# EAGLE design gateway_v1.2A (EAGLE 9.2.0)
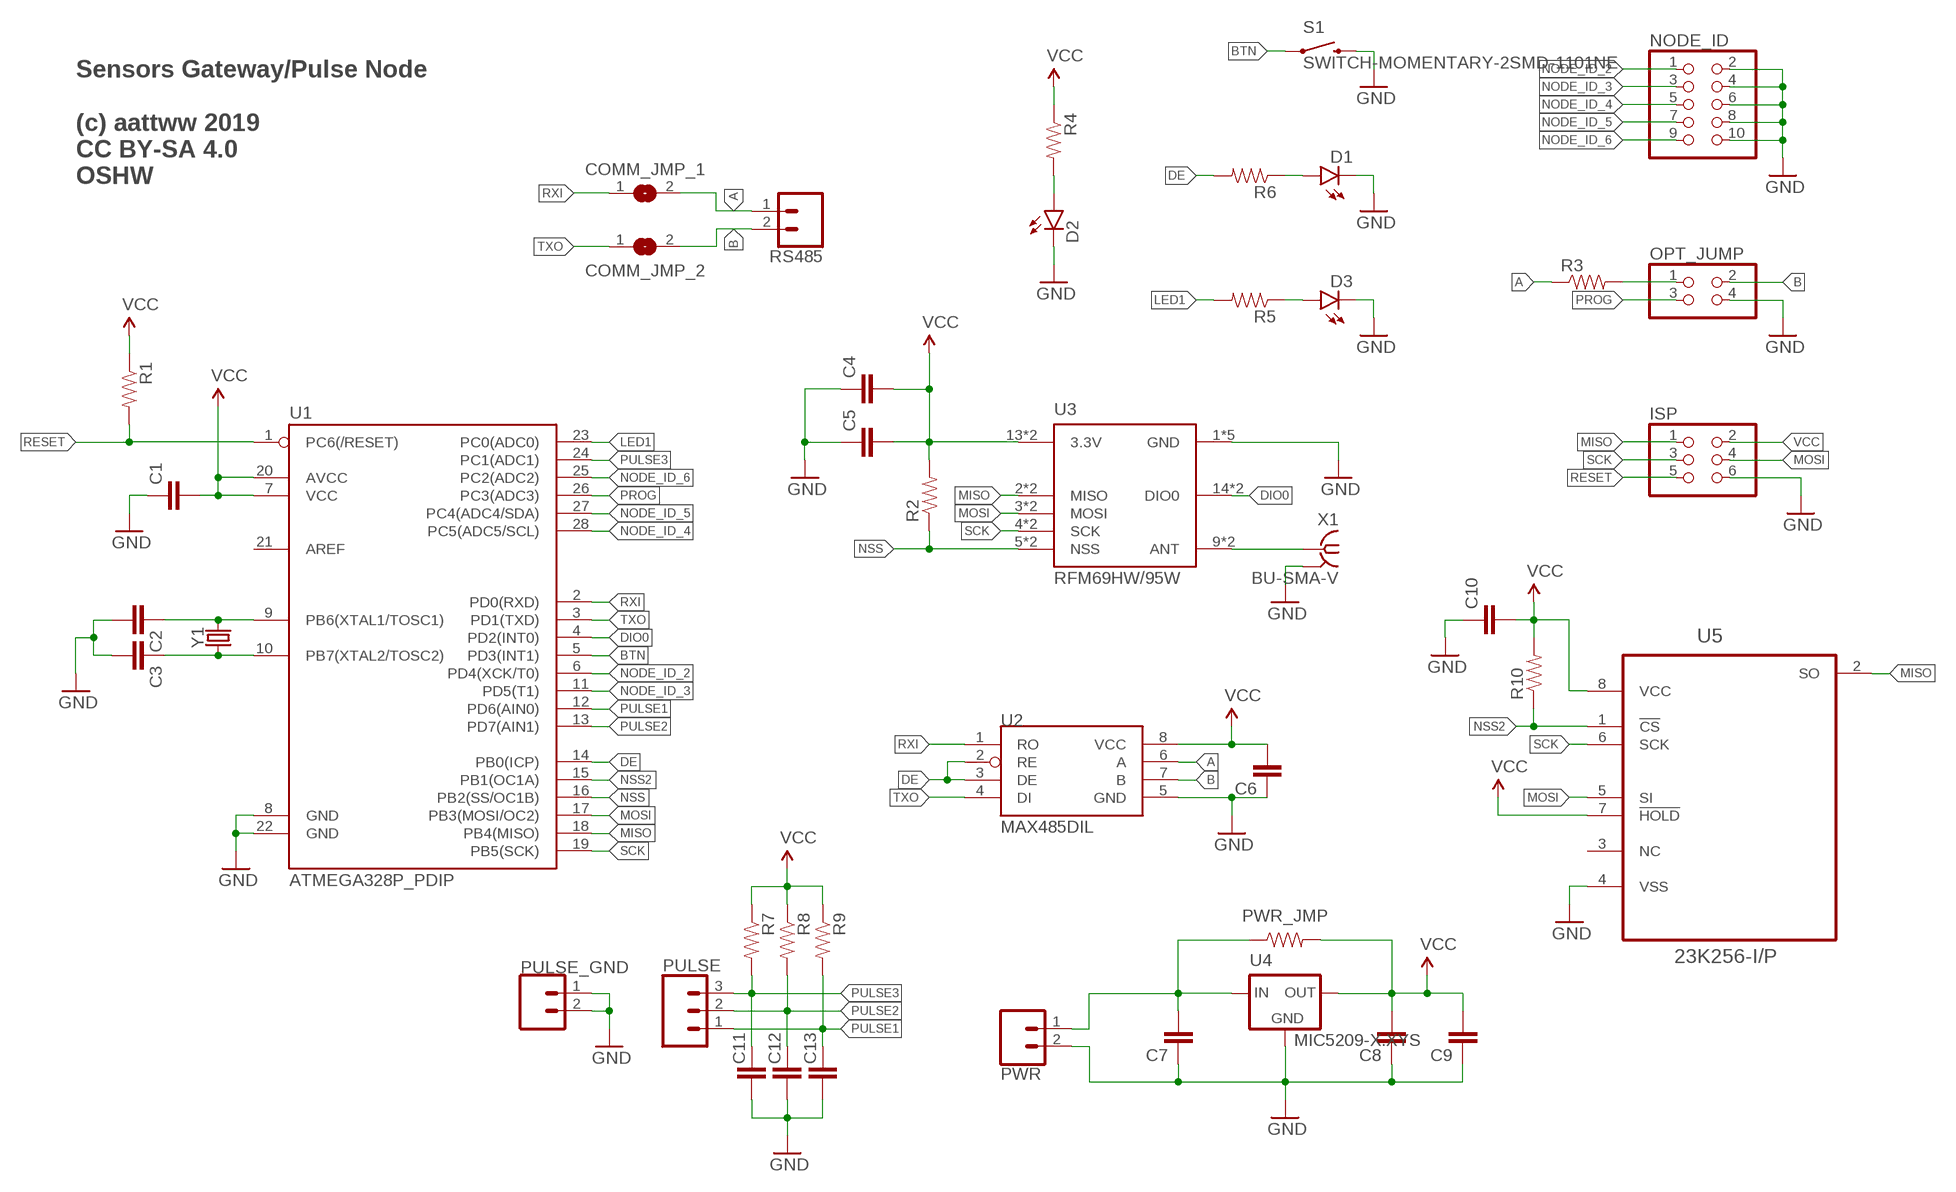
[diagram p0: schematic, sheet 1]

## Parts
C1  CAP1206  [1206]
C2  CAP1206  [1206]
C3  CAP1206  [1206]
C4  CAP1206  [1206]
C5  CAP1206  [1206]
C6  CAP1206  [1206]
C7  CAP1206  [1206]
C8  CAP1206  [1206]
C9  CAP1206  [1206]
C10  CAP1206  [1206]
C11  CAP1206  [1206]
C12  CAP1206  [1206]
C13  CAP1206  [1206]
COMM_JMP_1  SJ  [SJ]
COMM_JMP_2  SJ  [SJ]
D1  LED1206  [LED-1206]
D2  LED1206  [LED-1206]
D3  LED1206  [LED-1206]
ISP  PINHD-2X3  [2X03]
NODE_ID  PINHD-2X5  [2X05]
OPT_JUMP  PINHD-2X2  [2X02]
PULSE  CONN_03-SCREW-5MM  [SCREWTERMINAL-5MM-3]
PULSE_GND  CONN_025MM  [SCREWTERMINAL-5MM-2]
PWR  CONN_025MM  [SCREWTERMINAL-5MM-2]
PWR_JMP  RESISTOR1206  [1206]
R1  RESISTOR1206  [1206]
R2  RESISTOR1206  [1206]
R3  RESISTOR1206  [1206]
R4  RESISTOR1206  [1206]
R5  RESISTOR1206  [1206]
R6  RESISTOR1206  [1206]
R7  RESISTOR1206  [1206]
R8  RESISTOR1206  [1206]
R9  RESISTOR1206  [1206]
R10  RESISTOR1206  [1206]
RS485  CONN_025MM  [SCREWTERMINAL-5MM-2]
S1  SWITCH-MOMENTARY-2SMD-1101NE  [TACTILE-SWITCH-1101NE]
U1  ATMEGA328P_PDIP  [DIL28-3]
U2  MAX485DIL  [DIL08]
U3  RFM69HW/95W  [RFM69HW/95W]
U4  MIC5209-X.XYS  [SOT223]
U5  23K256-I/P  [DIP254P762X533-8]
X1  BU-SMA-V  [BU-SMA-V]
Y1  CRYSTALPTH-HC49US  [HC49US]

## Nets
A: COMM_JMP_1.2 R3.1 RS485.1 U2.6(A)
B: COMM_JMP_2.2 OPT_JUMP.2 RS485.2 U2.7(B)
BTN: S1.1 U1.5(PD3(INT1))
DE: R6.2 U1.14(PB0(ICP)) U2.2(RE) U2.3(DE)
DIO0: U1.4(PD2(INT0)) U3.14(DIO0) U3.22(DIO0)
GND: C1.1 C2.2 C3.2 C4.1 C5.1 C6.1 C7.1 C8.1 C9.1 C10.1 C11.2 C12.2 C13.2 D1.C D2.C D3.C ISP.6 NODE_ID.2 NODE_ID.4 NODE_ID.6 NODE_ID.8 NODE_ID.10 OPT_JUMP.4 PULSE_GND.1 PULSE_GND.2 PWR.2 S1.2 U1.8(GND) U1.22(GND) U2.5(GND) U3.1(GND) U3.8(GND) U3.10(GND) U3.29(GND) U3.31(GND) U4.2(GND) U4.4(GND) U5.4(VSS) X1.2 X1.3 X1.4 X1.5
LED1: R5.2 U1.23(PC0(ADC0))
MISO: ISP.1 U1.18(PB4(MISO)) U3.2(MISO) U3.33(MISO) U5.2(SO)
MOSI: ISP.4 U1.17(PB3(MOSI/OC2)) U3.3(MOSI) U3.34(MOSI) U5.5(SI)
N$1: U3.9(ANT) U3.30(ANT) X1.1
N$2: OPT_JUMP.1 R3.2
N$3: C2.1 U1.9(PB6(XTAL1/TOSC1)) Y1.2
N$4: C3.1 U1.10(PB7(XTAL2/TOSC2)) Y1.1
N$5: D2.A R4.2
N$6: D1.A R6.1
N$7: D3.A R5.1
N$8: C7.2 PWR.1 PWR_JMP.1 U4.1(IN)
NODE_ID_2: NODE_ID.1 U1.6(PD4(XCK/T0))
NODE_ID_3: NODE_ID.3 U1.11(PD5(T1))
NODE_ID_4: NODE_ID.5 U1.28(PC5(ADC5/SCL))
NODE_ID_5: NODE_ID.7 U1.27(PC4(ADC4/SDA))
NODE_ID_6: NODE_ID.9 U1.25(PC2(ADC2))
NSS: R2.1 U1.16(PB2(SS/OC1B)) U3.5(NSS) U3.35(NSS)
NSS2: R10.1 U1.15(PB1(OC1A)) U5.1(!CS)
PROG: OPT_JUMP.3 U1.26(PC3(ADC3))
PULSE1: C13.1 PULSE.1 R9.2 U1.12(PD6(AIN0))
PULSE2: C12.1 PULSE.2 R8.2 U1.13(PD7(AIN1))
PULSE3: C11.1 PULSE.3 R7.2 U1.24(PC1(ADC1))
RESET: ISP.5 R1.2 U1.1(PC6(/RESET))
RXI: COMM_JMP_1.1 U1.2(PD0(RXD)) U2.1(RO)
SCK: ISP.3 U1.19(PB5(SCK)) U3.4(SCK) U3.32(SCK) U5.6(SCK)
TXO: COMM_JMP_2.1 U1.3(PD1(TXD)) U2.4(DI)
VCC: C1.2 C4.2 C5.2 C6.2 C8.2 C9.2 C10.2 ISP.2 PWR_JMP.2 R1.1 R2.2 R4.1 R7.1 R8.1 R9.1 R10.2 U1.7(VCC) U1.20(AVCC) U2.8(VCC) U3.13(3.3V) U3.28(3.3V) U4.3(OUT) U5.7(!HOLD!) U5.8(VCC)
Unconnected: U1.21(AREF) U5.3(NC)

## Notes on the sheet
- Sensors Gateway/Pulse Node
  
  (c) aattww 2019
  CC BY-SA 4.0
  OSHW

## Library data of the parts
C1-C13 = SparkFun-Passives:CAP: Capacitor Standard 0603 ceramic capacitor, and 0.1" leaded capacitor.
COMM_JMP_1 COMM_JMP_2 = jumper:SJ: SMD solder JUMPER
D1-D3 = SparkFun-LED:LED: LEDs Standard schematic elements and footprints for 5mm, 3mm, 1206, and 0603 sized LEDs. 5mm - Spark Fun Electronics SKU : COM-00529 (and others)
ISP = pinhead:PINHD-2X3: PIN HEADER
NODE_ID = pinhead:PINHD-2X5: PIN HEADER
OPT_JUMP = pinhead:PINHD-2X2: PIN HEADER
PULSE = SparkFun-Connectors:CONN_03: Multi connection point. Often used as Generic Header-pin footprint for 0.1 inch spaced/style header connections On any of the 0.1 inch spaced packages, you can populate with these: Break Away Headers - Straight <https://www.sparkfun.com/products/116> (PRT-00116) Break Away Male Headers - Right Angle <https://www.sparkfun.com/products/553> (PRT-00553) Female Headers <https://www.sparkfun.com/products/115> (PRT-00115) Break Away Headers - Machine Pin <https://www.sparkfun.com/products/117> (PRT-00117) Break Away Female Headers - Swiss Machine Pin <https://www.sparkfun.com/products/743> (PRT-00743) Stackable Header - 3 Pin (Female, 0.1") <https://www.sparkfun.com/products/13875> (PRT-13875) For SCREWTERMINALS and SPRING TERMINALS visit here: Screw Terimnals on SparkFun.com <https://www.sparkfun.com/search/results?term=Screw+Terminals> (5mm/3.5mm/2.54mm spacing) This device is also useful as a general connection point to wire up your design to another part of your project. Our various solder wires solder well into these plated through hole pads. Hook-Up Wire - Assortment (Stranded, 22 AWG) <https://www.sparkfun.com/products/11375> (PRT-11375) Hook-Up Wire - Assortment (Solid Core, 22 AWG) <https://www.sparkfun.com/products/11367> (PRT-11367) View the entire wire category on our website here <https://www.sparkfun.com/categories/141> Special notes: Molex polarized connector foot print use with SKU : PRT-08232 with associated crimp pins and housings.; PROD_ID: CONN-10134; SF_SKU: PRT-08433
PULSE_GND PWR RS485 = SparkFun-Connectors:CONN_02: Multi connection point. Often used as Generic Header-pin footprint for 0.1 inch spaced/style header connections On any of the 0.1 inch spaced packages, you can populate with these: Break Away Headers - Straight <https://www.sparkfun.com/products/116> (PRT-00116) Break Away Male Headers - Right Angle <https://www.sparkfun.com/products/553> (PRT-00553) Female Headers <https://www.sparkfun.com/products/115> (PRT-00115) Break Away Headers - Machine Pin <https://www.sparkfun.com/products/117> (PRT-00117) Break Away Female Headers - Swiss Machine Pin <https://www.sparkfun.com/products/743> (PRT-00743) For SCREWTERMINALS and SPRING TERMINALS visit here: Screw Terimnals on SparkFun.com <https://www.sparkfun.com/search/results?term=Screw+Terminals> (5mm/3.5mm/2.54mm spacing) This device is also useful as a general connection point to wire up your design to another part of your project. Our various solder wires solder well into these plated through hole pads. Hook-Up Wire - Assortment (Stranded, 22 AWG) <https://www.sparkfun.com/products/11375> (PRT-11375) Hook-Up Wire - Assortment (Solid Core, 22 AWG) <https://www.sparkfun.com/products/11367> (PRT-11367) View the entire wire category on our website here <https://www.sparkfun.com/categories/141> Special notes: Molex polarized connector foot print use with: PRT-08233 with associated crimp pins and housings. 2.54_SCREWTERM for use with PRT-10571. 3.5mm Screw Terminal footprints for PRT-08084 5mm Screw Terminal footprints for use with PRT-08432; SF_SKU: PRT-08432
PWR_JMP R1-R10 = SparkFun-Passives:RESISTOR: Resistor Basic schematic elements and footprints for 0603, 1206, and PTH resistors.
S1 = SparkFun-Electromechanical:SWITCH-MOMENTARY-2: Various NO switches- pushbuttons, reed, etc; PROD_ID: SWCH-00815
U1 = SparkFun-DigitalIC:ATMEGA328P_PDIP: uC used in the Arduino 32kb flash, 1k EEPROM, 2k SRAM This is the through-hole version of this chip.
U2 = SparkFun-Retired:MAX485: RS-485 transceiver
U3 = custom-rfm:RFM69HW/95W
U4 = micrel:MIC5209-X.XYS: LDO REGULATOR
U5 = Microchip-23K256-I_P:23K256-I/P: SPI Bus Low-Power Serial SRAM,DIP-8; MPN: 23K256-I/P; OC_FARNELL: 1695546; OC_NEWARK: 08P0023; PACKAGE: DIP-8; SUPPLIER: MICROCHIP
X1 = con-coax:BU-SMA-V: FEMALE SMA CONNECTOR Radiall distributor RS 112-3794; OC_FARNELL: unknown; OC_NEWARK: unknown
Y1 = SparkFun-Clocks:CRYSTAL: Crystals (Generic) These are passive quartz crystals, which can be used as a clock source for a microcontroller. Crystal's are two-terminal devices. They require external "load" capacitors to generate an oscillating signal.

## Board
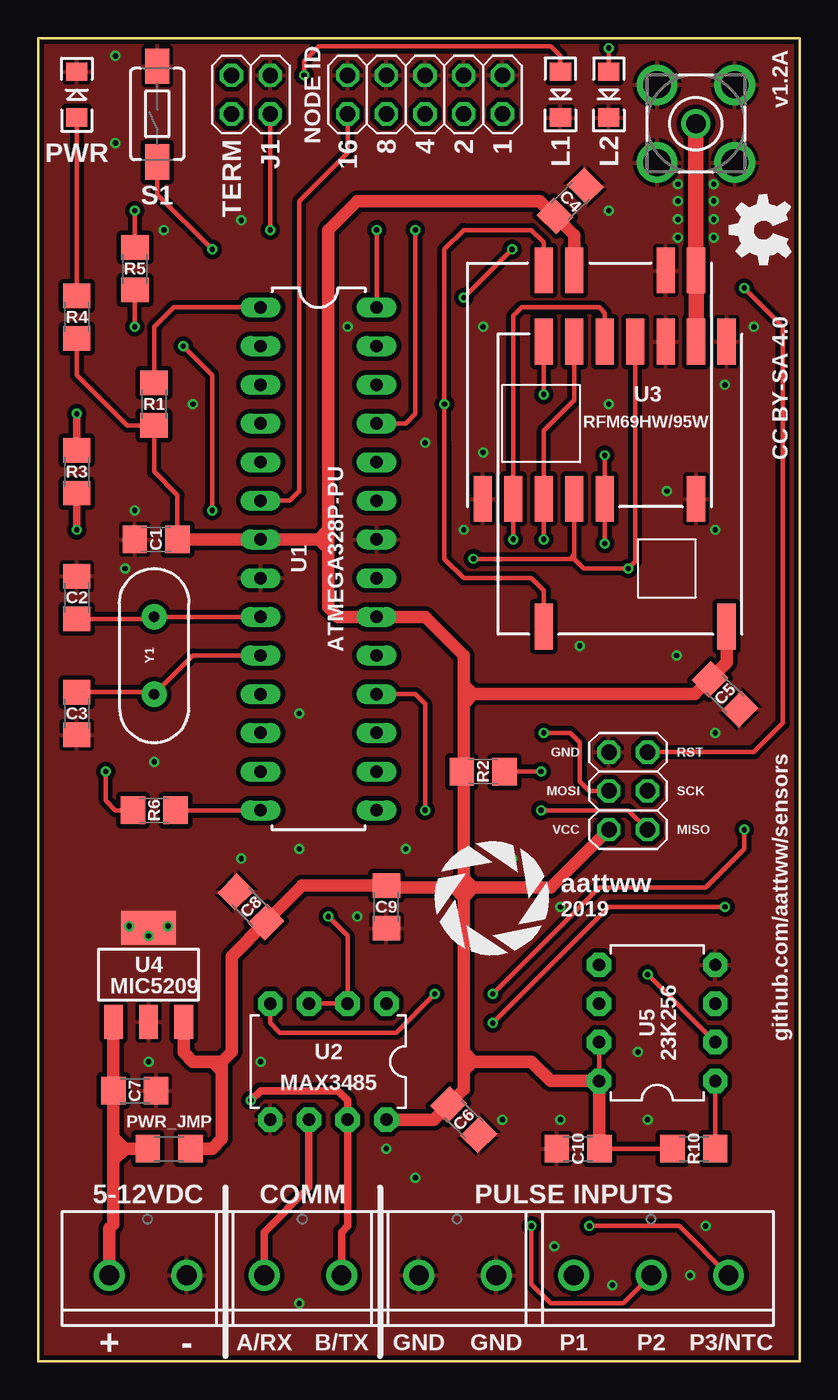
[diagram p1: board, top side]
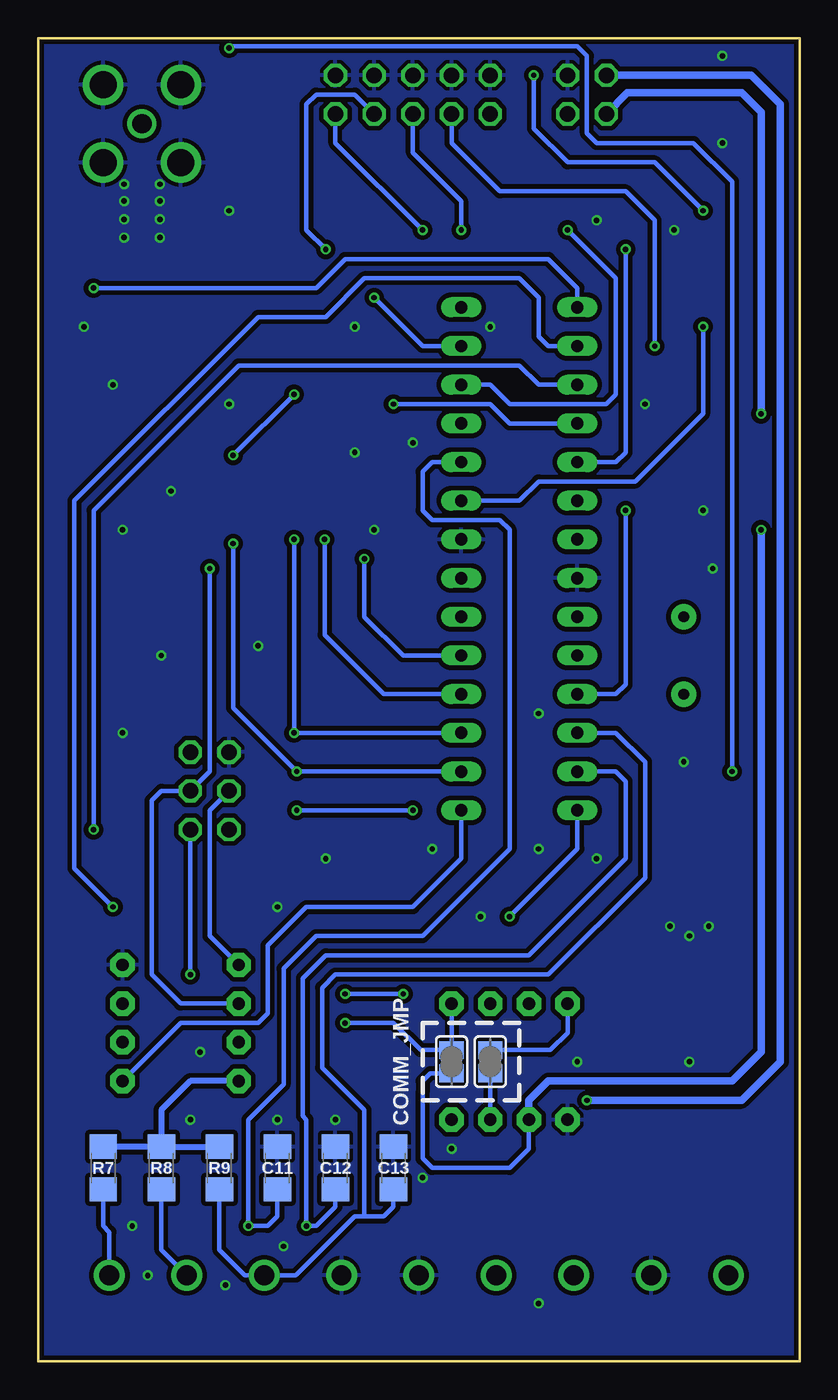
[diagram p2: board, bottom side, seen from below]

Size 50 x 86.9 mm. Coordinates in mm from the lower left corner, seen from the top.
Outline: 0,0 50,0 50,86.9 0,86.9 0,0
Copper layers (1*16): Top 0.035mm / dielectric 1.5mm / Bottom 0.035mm
Design rules "SeeedStudio_2layer_DRU_no_angle_20140221": minimum track width 6mil, minimum drill 12mil, track to track 6mil, track to pad 6mil, pad to pad 6mil, via to via 6mil, smd to smd 0mil, copper to edge 10mil, drill to drill 10mil, minimum pad ring 10mil, minimum via ring 6mil, stop-mask expansion 2mil, vias tented up to drill 100mil, thermal gap 10mil

### Footprints (pad centres in the part's own frame; a part is rotated, then mirrored left to right if it is on the bottom)
1206 = smd 1.6 x 1.8: 1 -1.4,0; 2 1.4,0
SJ = smd 1.168 x 1.6: 1 -0.762,0; 2 0.762,0
LED-1206 = smd 1.2 x 1.4: A -1.5,0; C 1.5,0
2X03 = drill 1.016 octagon: 1 -2.54,-1.27; 2 -2.54,1.27; 3 0,-1.27; 4 0,1.27; 5 2.54,-1.27; 6 2.54,1.27
2X05 = drill 1.016 octagon: 1 -5.08,-1.27; 2 -5.08,1.27; 3 -2.54,-1.27; 4 -2.54,1.27; 5 0,-1.27; 6 0,1.27; 7 2.54,-1.27; 8 2.54,1.27; 9 5.08,-1.27; 10 5.08,1.27
2X02 = drill 1.016 octagon: 1 -1.27,-1.27; 2 -1.27,1.27; 3 1.27,-1.27; 4 1.27,1.27
SCREWTERMINAL-5MM-3 = drill 1.3 pad 2.032: 1 0,0; 2 5.08,0; 3 10.16,0
SCREWTERMINAL-5MM-2 = drill 1.3 pad 2.032: 1 0,0; 2 5.08,0
TACTILE-SWITCH-1101NE = smd 2.3 x 1.6: 1 -3.15,0; 2 3.15,0
DIL28-3 = drill 0.813 long: 1 -16.51,-3.81; 2 -13.97,-3.81; 3 -11.43,-3.81; 4 -8.89,-3.81; 5 -6.35,-3.81; 6 -3.81,-3.81; 7 -1.27,-3.81; 8 1.27,-3.81; 9 3.81,-3.81; 10 6.35,-3.81; 11 8.89,-3.81; 12 11.43,-3.81; 13 13.97,-3.81; 14 16.51,-3.81; 15 16.51,3.81; 16 13.97,3.81; 17 11.43,3.81; 18 8.89,3.81; 19 6.35,3.81; 20 3.81,3.81; 21 1.27,3.81; 22 -1.27,3.81; 23 -3.81,3.81; 24 -6.35,3.81; 25 -8.89,3.81; 26 -11.43,3.81; 27 -13.97,3.81; 28 -16.51,3.81
DIL08 = drill 0.813 pad 1.6 octagon: 1 -3.81,-3.81; 2 -1.27,-3.81; 3 1.27,-3.81; 4 3.81,-3.81; 5 3.81,3.81; 6 1.27,3.81; 7 -1.27,3.81; 8 -3.81,3.81
RFM69HW/95W = smd 3 x 1.2: 1 -3.055,8.27; 2 -3.055,6.27; 3 -3.055,4.27; 4 -3.055,2.27; 5 -3.055,0.27; 8 -3.055,-5.73; 9 11.945,-5.73; 10 11.945,-3.73; 13 11.945,2.27; 14 11.945,4.27; 22 -11.43,4.27; 28 -11.43,-7.73; 29 7.27,-7.73; 30 7.27,-5.73; 31 7.27,-3.73; 32 7.27,-1.73; 33 7.27,0.27; 34 7.27,2.27; 35 7.27,4.27
SOT223 = smd 1.219 x 2.235: 1 -2.311,-3.099; 2 0,-3.099; 3 2.311,-3.099 | smd 3.6 x 2.2: 4 0,3.099
DIP254P762X533-8 = drill 0.813 pad 1.6 octagon: 1 -7.62,7.62; 2 -7.62,5.08; 3 -7.62,2.54; 4 -7.62,0; 5 0,0; 6 0,2.54; 7 0,5.08; 8 0,7.62
BU-SMA-V = drill 1.27: 1 0,0 | drill 1.778: 2 -2.55,2.55; 3 2.55,2.55; 4 2.55,-2.55; 5 -2.55,-2.55
HC49US = drill 0.7 pad 1.651: 1 -2.54,0; 2 2.54,0

### Placement (x,y rotation side)
C1  7.75,53.98 0 top
C2  2.54,50.16 90 top
C3  2.54,42.55 270 top
C4  34.92,76.2 225 top
C5  45.09,43.81 135 top
C6  27.94,15.88 135 top
C7  6.35,17.78 180 top
C8  13.97,29.84 315 top
C9  22.86,29.84 90 top
C10  35.45,13.97 0 top
C11  34.29,12.7 90 bottom
C12  30.48,12.7 90 bottom
C13  26.67,12.7 90 bottom
COMM_JMP_1  22.86,19.68 270 bottom
COMM_JMP_2  20.32,19.68 270 bottom
D1  37.47,83.19 270 top
D2  2.54,83.19 90 top
D3  34.29,83.19 270 top
ISP  38.73,37.47 90 top
NODE_ID  25.4,83.19 0 top
OPT_JUMP  13.97,83.19 0 top
PULSE  35.16,5.65 0 top
PULSE_GND  25,5.65 0 top
PWR  4.68,5.65 0 top
PWR_JMP  8.6,13.97 0 top
R1  7.62,62.87 90 top
R2  29.21,38.73 180 top
R3  2.54,58.42 90 top
R4  2.54,68.58 90 top
R5  6.35,71.75 270 top
R6  7.62,36.2 0 top
R7  45.72,12.7 270 bottom
R8  41.91,12.7 270 bottom
R9  38.1,12.7 270 bottom
R10  43.05,13.97 180 top
RS485  14.84,5.65 0 top
S1  7.83,81.92 90 top
U1  18.41,52.7 270 top
U2  19.05,19.68 180 top
U3  37.47,59.69 90 top
U4  7.25,25.4 0 top
U5  36.83,26.04 180 top
U$1  [OSHW_5MM]  47.62,74.3 90 top
U$3  [LOGO_7.5MM]  29.84,30.48 0 top
X1  43.18,81.28 0 top
Y1  7.62,46.35 90 top

### Tracks (layer width: path | path; a pad name or v marks a point on that pad's centre or on a via)
A  (via drill 0.35)
  Top 0.508: R3.1 v2.54,54.61 | U2.6 17.78,11.43 14.84,8.49 RS485.1
  Bottom 0.305: U2.6 17.78,13.97 19.05,12.7 24.13,12.7 24.77,13.34 24.77,17.65 24.77,18.41 24.26,18.92 COMM_JMP_1.2
  Bottom 0.508: v2.54,54.61 2.54,20.32 4.45,18.41 16.51,18.41 17.78,17.14 U2.6
B  (via drill 0.35)
  Top 0.508: v13.97,17.14 14.61,17.78 19.68,17.78 20.32,17.14 U2.7 20.32,8.89 19.92,8.49 RS485.2
  Bottom 0.305: COMM_JMP_2.2 U2.7
  Bottom 0.508: v13.97,17.14 3.81,17.14 1.27,19.68 1.27,82.55 3.17,84.45 OPT_JUMP.2
BTN  (via drill 0.35)
  Top 0.305: S1.1 7.83,76.63 v11.43,73.03
  Bottom 0.305: U1.5 12.06,59.05 11.43,59.69 v11.43,73.03
DE  (via drill 0.35)
  Top 0.305: v19.05,29.21 20.32,27.94 U2.2 U2.3 | R6.2 U1.14
  Bottom 0.305: U1.14 14.61,33.66 v19.05,29.21
DIO0  (via drill 0.35)
  Top 0.305: U3.14 33.2,73.48 32.38,74.3 27.94,74.3 26.67,73.03 v26.67,62.87 26.67,60.33 26.67,52.7 27.94,51.44 32.38,51.44 33.2,50.62 U3.22
  Bottom 0.305: v26.67,62.87 20.32,62.87 19.05,61.59 U1.4
GND  (via drill 0.35)
  other vias: 13.34,74.93 5.08,80.01 8.26,74.3 10.16,62.87 6.35,55.88 7.62,39.37 5.98,28.57 8.52,28.57 17.14,3.81 37.7,5.01 39.37,20.32 34.29,15.88 40.01,15.88 42.8,5.65 22.86,13.97 14.61,19.68 24.13,33.66 34.29,29.84 31.11,33.02 17.14,33.66 17.14,42.55 35.56,46.99 44.45,41.27 43.81,8.89 41.91,46.35 37.47,62.87 29.21,59.69 29.21,67.94 25.4,60.33 5.08,85.72 7.25,27.94 42,73.8 42,75 42,77.3 44.35,77.3 44.35,76.2 44.35,73.8 42,76.2 44.35,75 45.09,64.14 41.27,57.15 20.32,67.94 30.48,15.88 7.25,19.68 20.95,29.21 5.71,52.07 37.47,75.56 46.99,67.94 27.94,54.61 44.45,54.61 13.34,33.02 24.77,12.06 33.89,7.55
  pour Bottom (isolate 0.305): 0,0 0,86.9 50,86.9 50,0
  pour Top (isolate 0.305): 0,0 0,86.9 50,86.9 50,0
LED1  (via drill 0.35)
  Top 0.305: v6.35,67.94 R5.2
  Bottom 0.305: U1.23 18.41,56.52 17.14,57.78 10.79,57.78 6.35,62.23 v6.35,67.94
MISO  (via drill 0.35)
  Top 0.305: U3.33 37.2,68.85 36.83,69.22 31.75,69.22 31.2,68.66 U3.2 v31.2,53.98 | U1.18 24.77,43.81 25.4,43.18 v25.4,36.2 | U5.2 v40.01,25.4 | v33.02,36.2 38.73,36.2 ISP.1
  Bottom 0.305: U1.18 27.3,43.81 31.2,47.7 v31.2,53.98 | v33.02,36.2 v25.4,36.2 | ISP.1 v40.01,25.4
MOSI  (via drill 0.35)
  Top 0.305: U3.34 35.2,63.13 33.2,61.13 U3.3 v33.2,53.98 | v33.2,41.27 34.92,41.27 35.56,40.64 35.56,38.1 36.2,37.47 ISP.4
  Bottom 0.305: U1.17 v33.2,41.27 v33.2,53.98 | U5.5 38.73,27.94 38.73,36.2 ISP.4
N$1
  Top 1.016: X1.1 43.18,71.65 U3.9 U3.30
N$2  (via drill 0.35)
  Top 0.508: v2.54,62.23 R3.2
  Bottom 0.508: v2.54,62.23 2.54,82.03 3.81,83.3 11.31,83.3 OPT_JUMP.1
N$3
  Top 0.305: U1.9 Y1.2 7.49,48.77 C2.1
N$4
  Top 0.305: U1.10 10.16,46.35 Y1.1 7.49,43.95 C3.1
N$5
  Top 0.305: D2.A R4.2
N$6  (via drill 0.35)
  Top 0.305: R6.1 5.08,36.2 4.45,36.83 v4.45,38.73 | v37.47,86.24 D1.A
  Bottom 0.305: v37.47,86.24 37.35,86.36 14.61,86.36 13.97,85.72 13.97,80.64 13.34,80.01 6.99,80.01 4.45,77.47 v4.45,38.73
N$7  (via drill 0.35)
  Top 0.305: D3.A 34.29,85.72 33.66,86.36 18.41,86.36 17.46,85.41 v17.46,84.45 | v6.35,75.56 R5.1
  Bottom 0.305: v6.35,75.56 9.53,78.74 15.24,78.74 17.46,80.96 v17.46,84.45
N$8
  Top 0.813: U4.1 4.94,17.79 C7.2 4.95,14.73 | 4.95,13.21 4.95,9.02 4.68,8.75 PWR.1 | 4.95,13.21 4.95,13.97 | 4.95,14.73 4.95,13.97 | 5.71,13.97 4.95,13.97 | 4.95,14.73 5.71,13.97 | 4.95,13.21 5.71,13.97 | PWR_JMP.1 5.71,13.97
NODE_ID_2
  Top 0.305: U1.6 16.51,56.52 17.14,57.15 17.14,76.2 20.32,79.38 NODE_ID.1
NODE_ID_3  (via drill 0.35)
  Top 0.305: v11.43,55.88 11.43,64.77 v9.53,66.67
  Bottom 0.305: U1.11 12.06,43.81 11.43,44.45 v11.43,55.88 | v9.53,66.67 9.53,74.93 11.43,76.83 19.68,76.83 22.86,80.01 NODE_ID.3
NODE_ID_4  (via drill 0.35)
  Top 0.305: v22.23,74.3 U1.28
  Bottom 0.305: v22.23,74.3 22.23,76.2 25.4,79.38 NODE_ID.5
NODE_ID_5  (via drill 0.35)
  Top 0.305: v27.94,69.85 v31.11,73.03
  Bottom 0.305: U1.27 24.77,66.67 v27.94,69.85 | v31.11,73.03 32.38,74.3 32.38,82.55 31.75,83.19 29.21,83.19 NODE_ID.7
NODE_ID_6  (via drill 0.35)
  Top 0.305: v24.77,74.3 24.77,62.23 24.13,61.59 U1.25
  Bottom 0.305: v24.77,74.3 30.48,80.01 NODE_ID.9
NSS  (via drill 0.35)
  Top 0.305: v33.02,38.73 R2.1 | U3.35 v33.2,63.5 | v37.2,59.5 U3.5 v37.2,53.7
  Bottom 0.305: U1.16 v33.02,38.73 37.2,42.91 v37.2,53.7 | v33.2,63.5 v37.2,59.5
NSS2
  Top 0.305: U5.1 R10.1
  Bottom 0.305: U1.15 22.23,33.02 25.4,29.84 32.38,29.84 34.92,27.3 34.92,22.86 35.56,22.23 40.64,22.23 U5.1
PROG  (via drill 0.35)
  Top 0.305: v15.24,74.3 OPT_JUMP.3
  Bottom 0.305: U1.26 20.32,64.14 19.05,62.87 12.7,62.87 12.06,63.5 12.06,71.12 v15.24,74.3
PULSE1
  Bottom 0.305: U1.12 12.06,41.27 10.16,39.37 10.16,31.75 16.51,25.4 30.48,25.4 31.35,24.53 31.35,19.29 28.57,16.51 28.57,9.53 | R9.2 38.1,7.32 36.43,5.65 PULSE.1 33.09,5.65 29.21,9.53 28.57,9.53 | 28.57,9.53 27.3,9.53 26.67,10.16 C13.1
PULSE2  (via drill 0.35)
  Top 0.305: PULSE.2 38.4,3.81 33.66,3.81 32.38,5.08 v32.38,8.89
  Bottom 0.305: U1.13 12.06,38.73 11.43,38.1 11.43,33.02 17.78,26.67 31.11,26.67 32.62,25.16 32.62,16.11 32.38,15.88 v32.38,8.89 31.75,8.89 30.48,10.16 C12.1 | PULSE.2 41.91,7.32 R8.2
PULSE3  (via drill 0.35)
  Top 0.305: PULSE.3 42.08,8.89 v36.2,8.89
  Bottom 0.305: U1.24 24.13,59.05 24.77,58.42 24.77,55.88 24.13,55.24 19.68,55.24 19.05,54.61 19.05,33.66 24.77,27.94 31.75,27.94 33.89,25.8 33.89,18.18 36.2,15.88 v36.2,8.89 34.92,8.89 34.29,9.53 C11.1 | PULSE.3 45.32,8.49 45.72,8.89 R7.2
RESET  (via drill 0.35)
  Top 0.305: U1.1 8.89,69.22 7.62,67.94 R1.2 | v46.35,70.48 48.9,67.94 48.9,41.91 46.99,40.01 ISP.5
  Bottom 0.305: U1.1 14.61,70.48 16.51,72.39 29.84,72.39 31.75,70.48 v46.35,70.48
RXI  (via drill 0.35)
  Top 0.305: v45.09,29.84 37.47,29.84 v29.84,22.23
  Bottom 0.305: U1.2 16.51,66.67 17.14,67.31 17.14,69.85 18.41,71.12 28.57,71.12 31.11,68.58 35.56,68.58 47.62,56.52 47.62,32.38 v45.09,29.84 | U2.1 COMM_JMP_1.1 24.89,20.45 26.67,22.23 v29.84,22.23
SCK  (via drill 0.35)
  Top 0.305: U3.4 35.2,52.98 | 35.2,52.98 35.2,52.7 | U3.32 39.2,52.53 v38.73,52.07 35.83,52.07 35.2,52.7 | v28.57,52.7 34.92,52.7 | 34.92,52.7 35.2,52.7 | 34.92,52.7 35.2,52.98
  Bottom 0.305: U1.19 26.04,46.35 28.57,48.9 v28.57,52.7 | U5.6 40.64,23.5 42.55,25.4 42.55,36.83 41.91,37.47 ISP.3 38.73,38.73 v38.73,52.07
TXO  (via drill 0.35)
  Top 0.305: v46.35,34.92 46.35,33.66 43.81,31.11 36.83,31.11 v29.84,24.13 | U2.4 15.24,22.23 15.88,21.59 23.5,21.59 v26.04,24.13
  Bottom 0.305: U1.3 17.14,64.14 18.41,65.41 36.83,65.41 46.35,55.88 v46.35,34.92 | U2.4 15.24,21.59 16.38,20.45 COMM_JMP_2.1 | v29.84,24.13 v26.04,24.13
VCC
  Top 0.305: C1.2 9.15,56.89 7.62,58.42 R1.1 5.84,61.47 2.54,64.77 R4.1 | U5.8 U5.7 | R10.2 C10.2
  Top 0.813: C1.2 U1.7 18.41,53.98 | 27.94,44.45 27.94,46.35 25.4,48.9 U1.20 19.68,48.9 19.05,49.53 19.05,53.34 | 27.94,44.45 27.94,43.18 | 28.57,43.81 27.94,43.18 | 28.57,43.81 27.94,44.45 | 27.94,43.18 27.94,38.87 R2.2 27.94,38.6 27.94,31.75 | 28.57,31.11 27.94,31.11 | 27.94,31.11 27.94,31.75 | 27.94,31.11 27.3,31.11 | 27.3,31.11 22.99,31.11 C9.2 17.35,31.25 C8.2 12.7,26.59 12.7,20.32 12.06,19.68 | 27.3,31.11 27.94,31.75 | 27.94,31.75 28.57,31.11 | 19.05,54.61 19.05,53.34 | 19.05,54.61 19.05,74.3 20.95,76.2 32.95,76.2 C4.2 35.2,73.95 U3.13 | 19.05,54.61 18.41,53.98 | 27.94,31.11 27.94,30.48 | 27.3,31.11 27.94,30.48 | 27.94,30.48 28.57,31.11 | U3.28 45.2,45.91 C5.2 43.1,43.81 28.57,43.81 | 27.94,19.05 27.94,17.86 C6.2 25.96,15.88 U2.8 | 27.94,19.05 27.94,20.32 | 27.94,20.32 27.94,30.48 | U4.3 9.56,20.28 10.16,19.68 11.43,19.68 | 11.43,19.68 12.06,19.68 | 18.41,53.98 19.05,53.34 | 28.57,19.68 32.38,19.68 33.66,18.41 U5.8 36.85,18.39 C10.2 | 28.57,19.68 27.94,19.05 | 28.57,19.68 27.94,20.32 | ISP.2 33.66,31.11 28.57,31.11 | 12.06,19.05 12.06,14.61 11.43,13.97 PWR_JMP.2 | 12.06,19.05 12.06,19.68 | 11.43,19.68 12.06,19.05
  Bottom 0.406: U5.8 40.01,18.41 41.91,16.51 R8.1 | R8.1 R7.1 | R8.1 R9.1

### Text on the board
tNames: v1.2A | NODE ID | TERM | J1 | 16 | 8 | 4 | 2 | 1 | L1 | L2 | PWR | U3 | CC BY-SA 4.0 | U1 | ATMEGA328P-PU | GND | RST | MOSI | SCK | VCC | MISO | 2019 | aattww | github.com/aattww/sensors | MIC5209 | 23K256 | U2 | MAX3485 | 5-12VDC | COMM | PULSE INPUTS | + | - | A/RX | B/TX | GND | GND | P1 | P2 | P3/NTC
bNames: COMM_JMP
Document: Enclosure: Bud Industries DMB-4771